# Altium schematic sheet 11_INPUT.SchDoc
size A4; PageSetup: Record=PageOptions|CenterHorizontal=True|CenterVertical=True|PrintScale=0.97|XCorrection=1.00|YCorrection=1.00|PrintKind=0|BorderSize=5000000|LeftOffset=0|BottomOffset=0|Orientation=2|PaperLength=1000|PaperWidth=1000|Scale=100|PaperSource=7|PrintQuality=-4|MediaType=1|DitherType=10|PaperKind=A4|PrintScaleMode=1
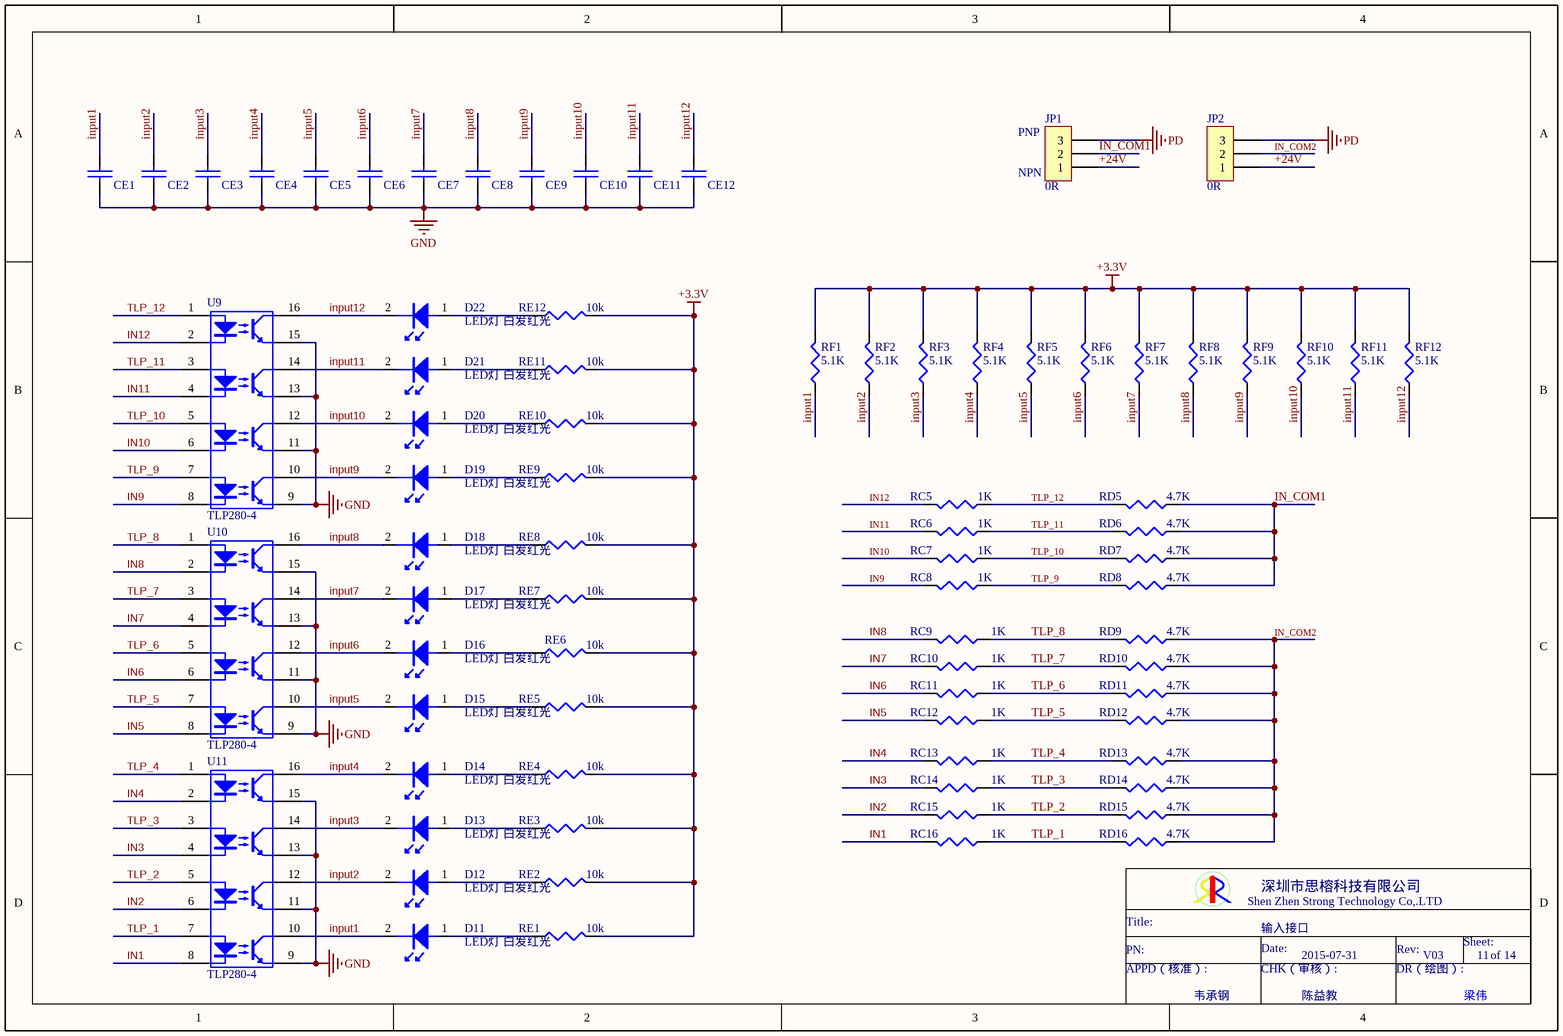
[diagram p0: 11_INPUT.SchDoc]

## Parts
CE1  100pF  [0603C]  (value not drawn)
CE2  100pF  [0603C]  (value not drawn)
CE3  100pF  [0603C]  (value not drawn)
CE4  100pF  [0603C]  (value not drawn)
CE5  100pF  [0603C]  (value not drawn)
CE6  100pF  [0603C]  (value not drawn)
CE7  100pF  [0603C]  (value not drawn)
CE8  100pF  [0603C]  (value not drawn)
CE9  100pF  [0603C]  (value not drawn)
CE10  100pF  [0603C]  (value not drawn)
CE11  100pF  [0603C]  (value not drawn)
CE12  100pF  [0603C]  (value not drawn)
D11  LED灯 白发红光  [D0603]
D12  LED灯 白发红光  [D0603]
D13  LED灯 白发红光  [D0603]
D14  LED灯 白发红光  [D0603]
D15  LED灯 白发红光  [D0603]
D16  LED灯 白发红光  [D0603]
D17  LED灯 白发红光  [D0603]
D18  LED灯 白发红光  [D0603]
D19  LED灯 白发红光  [D0603]
D20  LED灯 白发红光  [D0603]
D21  LED灯 白发红光  [D0603]
D22  LED灯 白发红光  [D0603]
JP1  0R  [3*0.6]
JP2  0R  [3*0.6]
RC5  1K  [0603R]
RC6  1K  [0603R]
RC7  1K  [0603R]
RC8  1K  [0603R]
RC9  1K  [0603R]
RC10  1K  [0603R]
RC11  1K  [0603R]
RC12  1K  [0603R]
RC13  1K  [0603R]
RC14  1K  [0603R]
RC15  1K  [0603R]
RC16  1K  [0603R]
RD5  4.7K  [1206R]
RD6  4.7K  [1206R]
RD7  4.7K  [1206R]
RD8  4.7K  [1206R]
RD9  4.7K  [1206R]
RD10  4.7K  [1206R]
RD11  4.7K  [1206R]
RD12  4.7K  [1206R]
RD13  4.7K  [1206R]
RD14  4.7K  [1206R]
RD15  4.7K  [1206R]
RD16  4.7K  [1206R]
RE1  10k  [0603R]
RE2  10k  [0603R]
RE3  10k  [0603R]
RE4  10k  [0603R]
RE5  10k  [0603R]
RE6  10k  [0603R]
RE7  10k  [0603R]
RE8  10k  [0603R]
RE9  10k  [0603R]
RE10  10k  [0603R]
RE11  10k  [0603R]
RE12  10k  [0603R]
RF1  5.1K  [0603R]
RF2  5.1K  [0603R]
RF3  5.1K  [0603R]
RF4  5.1K  [0603R]
RF5  5.1K  [0603R]
RF6  5.1K  [0603R]
RF7  5.1K  [0603R]
RF8  5.1K  [0603R]
RF9  5.1K  [0603R]
RF10  5.1K  [0603R]
RF11  5.1K  [0603R]
RF12  5.1K  [0603R]
U9  TLP280-4  [SOP16]
U10  TLP280-4  [SOP16]
U11  TLP280-4  [SOP16]

## Nets
+3.3V: RE1.2 RE2.2 RE3.2 RE4.2 RE5.2 RE6.2 RE7.2 RE8.2 RE9.1 RE10.1 RE11.1 RE12.1 RF1.2 RF2.2 RF3.2 RF4.2 RF5.2 RF6.2 RF7.2 RF8.2 RF9.2 RF10.2 RF11.2 RF12.2
GND: CE1.2 CE2.2 CE3.2 CE4.2 CE5.2 CE6.2 CE7.2 CE8.2 CE9.2 CE10.2 CE11.2 CE12.2 U9.9(Emitter) U9.11(Emitter) U9.13(Emitter) U9.15(Emitter) U10.9(Emitter) U10.11(Emitter) U10.13(Emitter) U10.15(Emitter) U11.9(Emitter) U11.11(Emitter) U11.13(Emitter) U11.15(Emitter)
PD: JP1.3 JP2.3
+24V: JP1.1 JP2.1
IN1: RC16.2 U11.8(LED_Cathode)
IN2: RC15.2 U11.6(LED_Cathode)
IN3: RC14.2 U11.4(LED_Cathode)
IN4: RC13.2 U11.2(LED_Cathode)
IN5: RC12.2 U10.8(LED_Cathode)
IN6: RC11.2 U10.6(LED_Cathode)
IN7: RC10.2 U10.4(LED_Cathode)
IN8: RC9.2 U10.2(LED_Cathode)
IN9: RC8.2 U9.8(LED_Cathode)
IN10: RC7.2 U9.6(LED_Cathode)
IN11: RC6.2 U9.4(LED_Cathode)
IN12: RC5.2 U9.2(LED_Cathode)
IN_COM1: JP1.2 RD5.1 RD6.1 RD7.1 RD8.1
IN_COM2: JP2.2 RD9.1 RD10.1 RD11.1 RD12.1 RD13.1 RD14.1 RD15.1 RD16.1
input1: CE1.1 D11.2 RF1.1 U11.10(Collector)
input2: CE2.1 D12.2 RF2.1 U11.12(Collector)
input3: CE3.1 D13.2 RF3.1 U11.14(Collector)
input4: CE4.1 D14.2 RF4.1 U11.16(Collector)
input5: CE5.1 D15.2 RF5.1 U10.10(Collector)
input6: CE6.1 D16.2 RF6.1 U10.12(Collector)
input7: CE7.1 D17.2 RF7.1 U10.14(Collector)
input8: CE8.1 D18.2 RF8.1 U10.16(Collector)
input9: CE9.1 D19.2 RF9.1 U9.10(Collector)
input10: CE10.1 D20.2 RF10.1 U9.12(Collector)
input11: CE11.1 D21.2 RF11.1 U9.14(Collector)
input12: CE12.1 D22.2 RF12.1 U9.16(Collector)
TLP_1: RC16.1 RD16.2 U11.7(LED_Anode)
TLP_2: RC15.1 RD15.2 U11.5(LED_Anode)
TLP_3: RC14.1 RD14.2 U11.3(LED_Anode)
TLP_4: RC13.1 RD13.2 U11.1(LED_Anode)
TLP_5: RC12.1 RD12.2 U10.7(LED_Anode)
TLP_6: RC11.1 RD11.2 U10.5(LED_Anode)
TLP_7: RC10.1 RD10.2 U10.3(LED_Anode)
TLP_8: RC9.1 RD9.2 U10.1(LED_Anode)
TLP_9: RC8.1 RD8.2 U9.7(LED_Anode)
TLP_10: RC7.1 RD7.2 U9.5(LED_Anode)
TLP_11: RC6.1 RD6.2 U9.3(LED_Anode)
TLP_12: RC5.1 RD5.2 U9.1(LED_Anode)
NetD11_1: D11.1 RE1.1
NetD12_1: D12.1 RE2.1
NetD13_1: D13.1 RE3.1
NetD14_1: D14.1 RE4.1
NetD15_1: D15.1 RE5.1
NetD16_1: D16.1 RE6.1
NetD17_1: D17.1 RE7.1
NetD18_1: D18.1 RE8.1
NetD19_1: D19.1 RE9.2
NetD20_1: D20.1 RE10.2
NetD21_1: D21.1 RE11.2
NetD22_1: D22.1 RE12.2

## Notes on the sheet
- (near JP1) NPN
- (near JP1) PNP
- 输入接口
- 2015-07-31
- V03
- 11
- 14
- 韦承钢
- 陈益教
- Shen Zhen Strong Technology Co,.LTD
- 深圳市思榕科技有限公司
- Title:
- PN:
- APPD（核准）:
- Date:
- CHK（审核）:
- DR（绘图）:
- Rev:
- Sheet:
- of
- 梁伟

## Library data of the parts
CE1-CE12 = CAP: Capacitor
D11-D22 = LED: LED灯
JP1 JP2 = CON3: Connector
RC5-RC16 RD5-RD16 RE1-RE12 RF1-RF12 = RES1